# Altium schematic sheet RelayNode.SchDoc
size A4
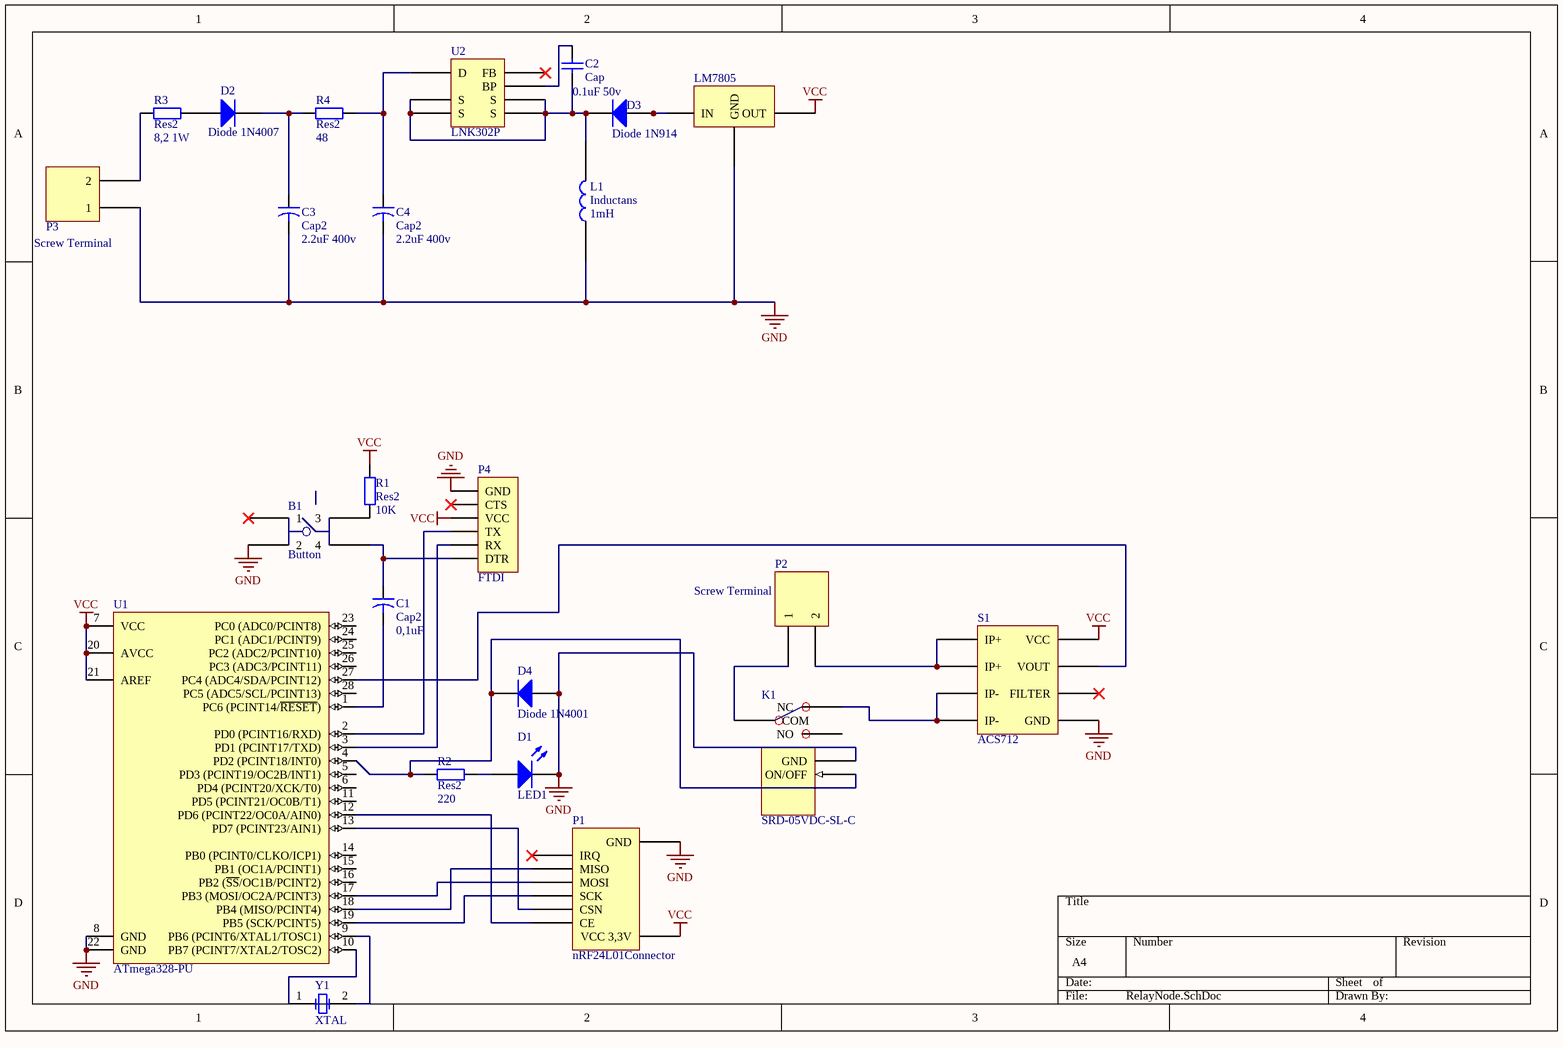
[diagram p0: RelayNode.SchDoc]

## Parts
B1  Button  [Button]
C1  Cap2  value 0,1uF  [CAPR5-4X5]
C2  Cap  value 0.1uF 50v  [RAD-0.3]
C3  Cap2  value 2.2uF 400v  [CAPR5-4X5]
C4  Cap2  value 2.2uF 400v  [CAPR5-4X5]
D1  LED1  [LED-1]
D2  Diode 1N4007  [DO-41]
D3  Diode 1N914  [DO-35]
D4  Diode 1N4001  [DO-41]
K1  SRD-05VDC-SL-C  [SRD-05VDC-SL-C]
L1  Inductans  value 1mH  [Axial 0.8]
LM7805  (no value)  [TO-220-AB]
P1  nRF24L01Connector  [HDR2X4]
P2  Screw Terminal  [PCBComponent_1]
P3  Screw Terminal  [PCBComponent_1]
P4  FTDI  [HDR1X6]
R1  Res2  value 10K  [AXIAL-0.4]
R2  Res2  value 220  [AXIAL-0.4]
R3  Res2  value 8,2 1W  [Axial 1.0]
R4  Res2  value 48  [AXIAL-0.4]
S1  ACS712  [SOIC127P600X175-8N]
U1  ATmega328-PU  [28P3]
U2  LNK302P  [LNK302 - duplicate]
Y1  XTAL  [R38]

## Nets
GND: B1.2 C3.2 C4.2 D1.2(K) D4.1(A) K1.4(GND) L1.2 LM7805.2(GND) P1.2(GND) P3.1 P4.1(GND) S1.5(GND) U1.8(GND) U1.22(GND)
VCC: LM7805.3(OUT) P1.1(VCC_3,3V) P4.3(VCC) R1.2 S1.8(VCC) U1.7(VCC) U1.20(AVCC) U1.21(AREF)
NetB1_3: B1.3 R1.1
NetB1_4: B1.4 C1.1 P4.6(DTR)
NetC1_2: C1.2 U1.1(PC6_(PCINT14/~{RESET}))
NetC2_1: C2.1 D3.2(K) L1.1 U2.1(S) U2.2(S) U2.7(S) U2.8(S)
NetC2_2: C2.2 U2.3(BP)
NetC3_1: C3.1 D2.2(K) R4.1
NetC4_1: C4.1 R4.2 U2.5(D)
NetD1_1: D1.1(A) R2.2
NetD2_1: D2.1(A) R3.2
NetD3_1: D3.1(A) LM7805.1(IN)
NetD4_2: D4.2(K) K1.5(ON/OFF) R2.1 U1.4(PD2_(PCINT18/INT0))
NetK1_1: K1.1(COM) P2.1
NetK1_2: K1.2(NC) S1.3(IP-)
NetP1_3: P1.3(CE) U1.12(PD6_(PCINT22/OC0A/AIN0))
NetP1_4: P1.4(CSN) U1.13(PD7_(PCINT23/AIN1))
NetP1_5: P1.5(SCK) U1.19(PB5_(SCK/PCINT5))
NetP1_6: P1.6(MOSI) U1.17(PB3_(MOSI/OC2A/PCINT3))
NetP1_7: P1.7(MISO) U1.18(PB4_(MISO/PCINT4))
NetP2_2: P2.2 S1.1(IP+)
NetP3_2: P3.2 R3.1
NetP4_4: P4.4(TX) U1.2(PD0_(PCINT16/RXD))
NetP4_5: P4.5(RX) U1.3(PD1_(PCINT17/TXD))
NetS1_7: S1.7(VOUT) U1.27(PC4_(ADC4/SDA/PCINT12))
NetU1_9: U1.9(PB6_(PCINT6/XTAL1/TOSC1)) Y1.2(OSC2)
NetU1_10: U1.10(PB7_(PCINT7/XTAL2/TOSC2)) Y1.1(OSC1)

Not connected (* = marked no-connect by the designer): B1 1*; K1 3(NO); P1 8(IRQ)*; P4 2(CTS)*; S1 6(FILTER)*; U1 5(PD3_(PCINT19/OC2B/INT1)) 6(PD4_(PCINT20/XCK/T0)) 11(PD5_(PCINT21/OC0B/T1)) 14(PB0_(PCINT0/CLKO/ICP1)) 15(PB1_(OC1A/PCINT1)) 16(PB2_(~{SS}/OC1B/PCINT2)) 23(PC0_(ADC0/PCINT8)) 24(PC1_(ADC1/PCINT9)) 25(PC2_(ADC2/PCINT10)) 26(PC3_(ADC3/PCINT11)) 28(PC5_(ADC5/SCL/PCINT13)); U2 4(FB)*

## Library data of the parts
C1 C3 C4 = Cap2: Capacitor; Published: 23-Sep-2002; PackageReference: CAPR5-4X5; Publisher: Altium Limited; PackageDescription: Capacitor; 2 Leads
C2 = Cap: Capacitor; Published: 8-Jun-2000; LatestRevisionDate: 17-Jul-2002; LatestRevisionNote: Re-released for DXP Platform.; PackageReference: RAD-0.3; Publisher: Altium Limited; PackageDescription: Radial Cap, Thru-Hole; 2 Leads; 0.3 in Pin Spacing
D1 = LED1: Typical RED GaAs LED; Published: 8-Jun-2000; LatestRevisionDate: 08-Jul-2005; LatestRevisionNote: Mech Layer 1 removed.; PackageReference: LED-1; Publisher: Altium Limited; PackageDescription: LED; 2 Leads
D2 = Diode 1N4007: 1 Amp General Purpose Rectifier; Published: 8-Jun-2000; LatestRevisionDate: 17-Jul-2002; LatestRevisionNote: Re-released for DXP Platform.; DatasheetVersion: 1998; PackageVersion: Aug-1999; PackageReference: DO-41; Publisher: Altium Limited; PackageDescription: Diode, Axial; Body 5.2 x 2.7 mm (LxDia. max), Lead Dia. 0.86 mm (max); Code_JEDEC: DO-204-AL; ComponentLink1Description: Manufacturer Link; ComponentLink1URL: http://www.fairchildsemi.com/; ComponentLink2Description: Datasheet; ComponentLink2URL: http://www.fairchildsemi.com/ds/1N%2F1N4001.pdf
D3 = Diode 1N914: High Conductance Fast Diode; Published: 8-Jun-2000; LatestRevisionDate: 17-Jul-2002; LatestRevisionNote: Re-released for DXP Platform.; DatasheetVersion: 1997; PackageReference: DO-35; Publisher: Altium Limited; PackageDescription: Diode, Axial; Body 3.8 x 1.9 mm (LxDia. max), Lead Dia. 0.53 mm (max); Code_JEDEC: DO-204-AH; ComponentLink1Description: Manufacturer Link; ComponentLink1URL: http://www.fairchildsemi.com/; ComponentLink2Description: Datasheet; ComponentLink2URL: http://www.fairchildsemi.com/ds/1N%2F1N4448.pdf
D4 = Diode 1N4001: 1 Amp General Purpose Rectifier; Published: 8-Jun-2000; LatestRevisionDate: 17-Jul-2002; LatestRevisionNote: Re-released for DXP Platform.; DatasheetVersion: 1998; PackageVersion: Aug-1999; PackageReference: DO-41; Publisher: Altium Limited; PackageDescription: Diode, Axial; Body 5.2 x 2.7 mm (LxDia. max), Lead Dia. 0.86 mm (max); Code_JEDEC: DO-204-AL; ComponentLink1Description: Manufacturer Link; ComponentLink1URL: http://www.fairchildsemi.com/; ComponentLink2Description: Datasheet; ComponentLink2URL: http://www.fairchildsemi.com/ds/1N%2F1N4001.pdf
LM7805 = LM7805: Supplier 1: Farnell
P2 P3 = Screw Terminal: Screw Terminal Block Connector 2 Pins
P4 = Header 6: Header, 6-Pin; LatestRevisionDate: 17-Jul-2002; LatestRevisionNote: Re-released for DXP Platform.; Publisher: Altium Limited
R1-R4 = Res2: Resistor; Published: 8-Jun-2000; LatestRevisionDate: 17-Jul-2002; LatestRevisionNote: Re-released for DXP Platform.; PackageReference: AXIAL-0.4; Publisher: Altium Limited; PackageDescription: Axial Device, Thru-Hole; 2 Leads; 0.4 in Pin Spacing
U1 = ATmega328-PU: 8-bit AVR Microcontroller, 32KB Flash, 1KB EEPROM, 2KB SRAM, 28-pin PDIP, Industrial Grade (-40°C to 85°C); Published: 1-Apr-2010; DatasheetVersion: revA, Jan-2010; PackageVersion: revB, Sep-2001; PackageReference: 28P3; Publisher: Altium Limited; PackageDescription: 28-lead (0.300"/7.62mm Wide) Plastic Dual Inline Package (PDIP); Supplier 1: Digi-Key; Supplier Part Number 1: ATMEGA328-PU-ND; Supplier 2: Mouser; Supplier Part Number 2: 556-ATMEGA328-PU; ComponentLink1Description: Manufacturer Link; ComponentLink1URL: http://www.atmel.com/products/avr/default.asp?; ComponentLink2Description: ATmega48A/48PA/88A/88PA/168A/168PA/328/328P Datasheet; ComponentLink2URL: http://www.atmel.com/dyn/resources/prod_documents/8271.pdf; ComponentLink3Description: ATmega48A/48PA/88A/88PA/168A/168PA/328/328P Summary; ComponentLink3URL: http://www.atmel.com/dyn/resources/prod_documents/8271S.pdf; ComponentLink4Description: Atmel.com Home; ComponentLink4URL: http://www.atmel.com
U2 = LNK302P: LNK302P DIP
Y1 = XTAL: Crystal Oscillator; Published: 8-Jun-2000; LatestRevisionDate: 17-Jul-2002; LatestRevisionNote: Re-released for DXP Platform.; PackageReference: R38; Publisher: Altium Limited; PackageDescription: Crystal, Thru-Hole; 2 Leads; Body 3.1 x 8.2 mm (Dia.xH)